# EAGLE schematic dice_3 (1) (EAGLE 9.6.2)
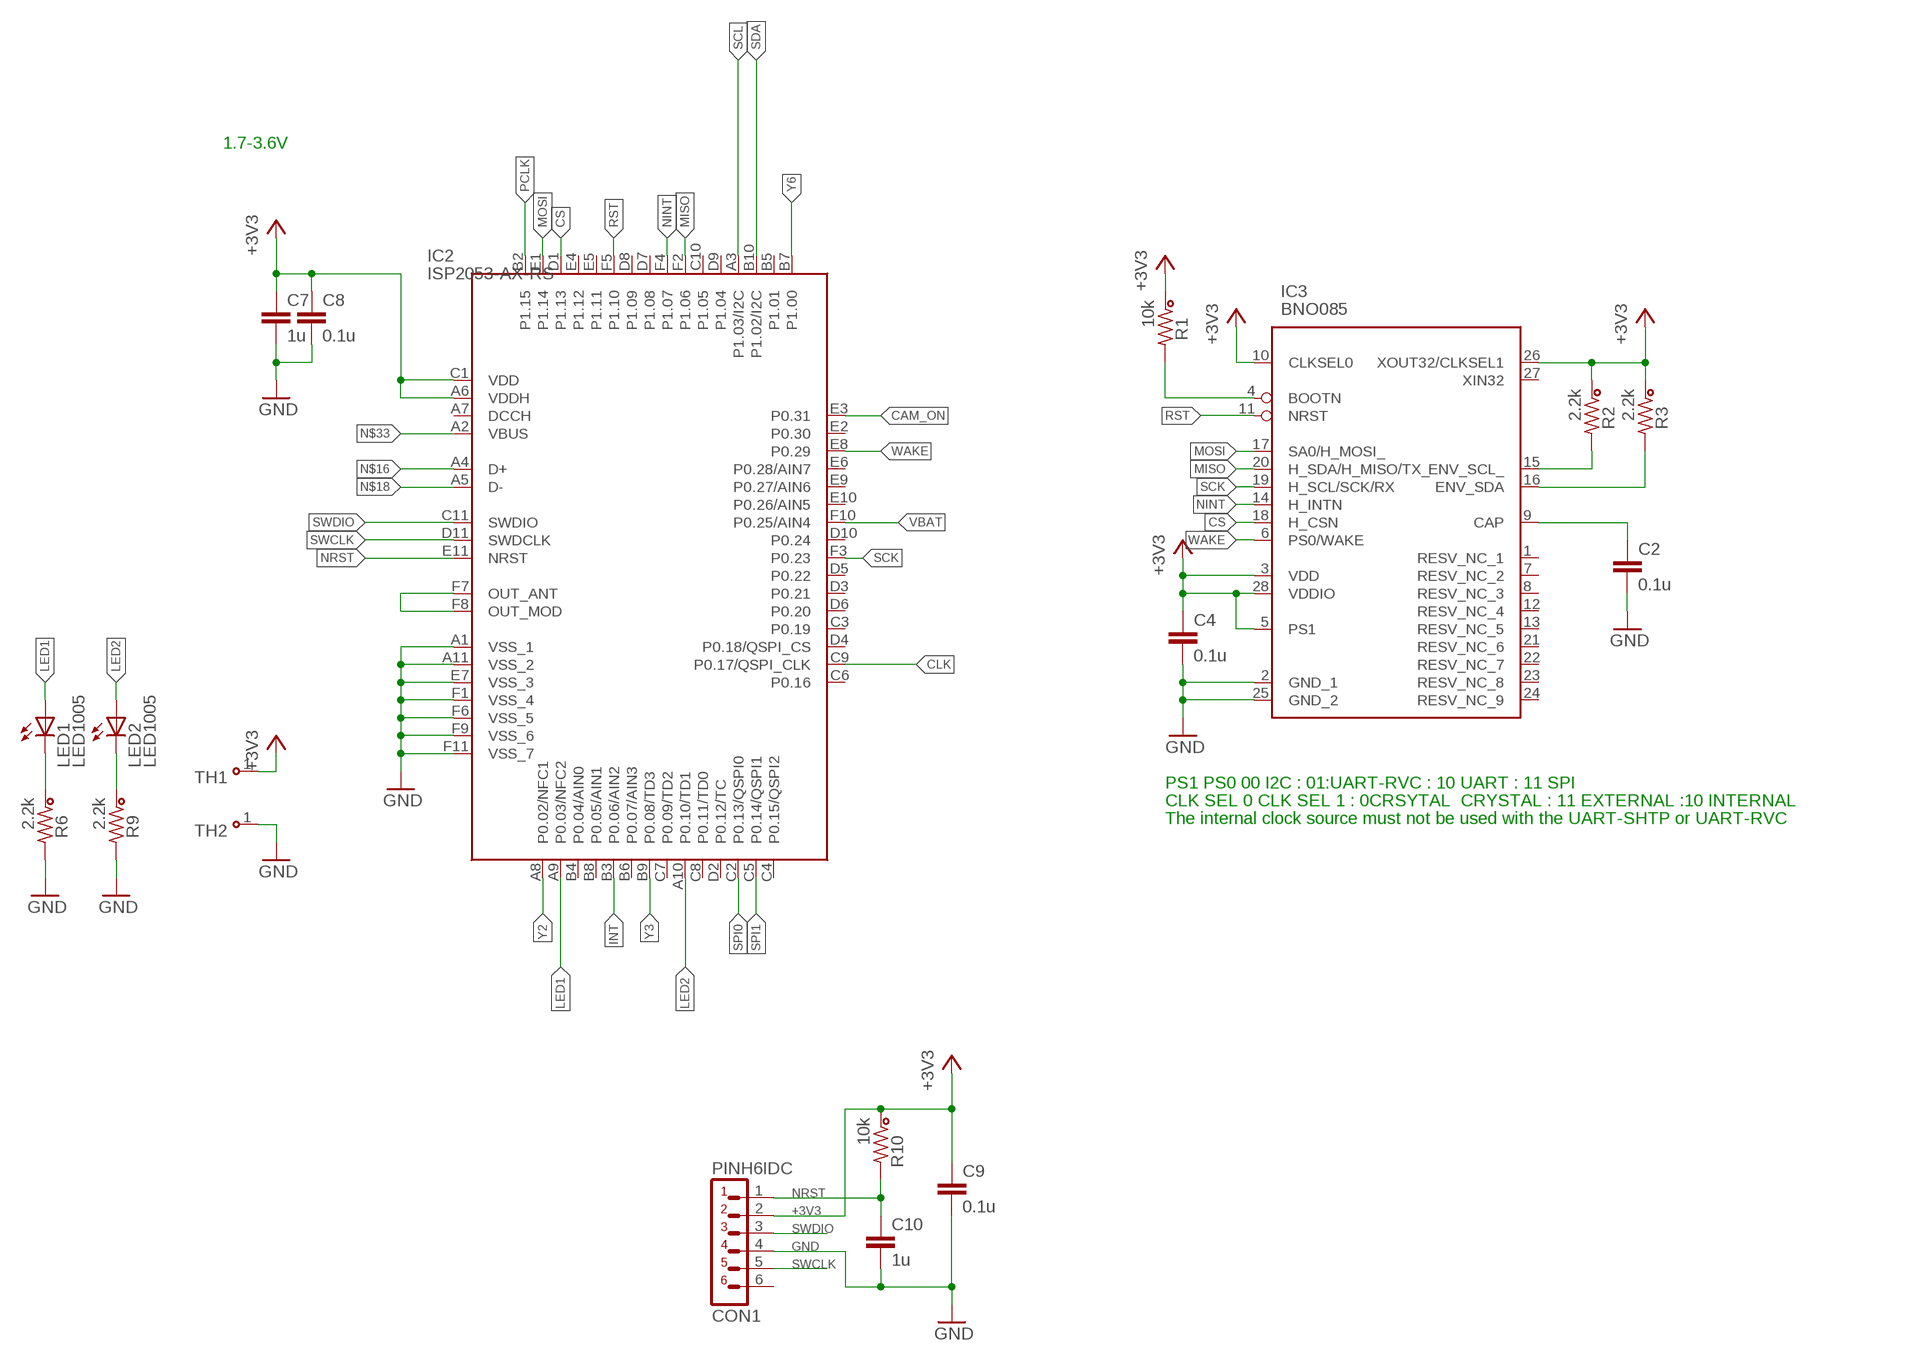
[diagram p0: schematic, sheet 1]

## Parts
C2  0.1u  C-CC1005K  [1005K]
C4  0.1u  C-CC1005K  [1005K]
C7  1u  C-CC1005K  [1005K]
C8  0.1u  C-CC1005K  [1005K]
C9  0.1u  C-CC1005K  [1005K]
C10  1u  C-CC1005K  [1005K]
CON1  PINH6IDC  [1X6IDC_1R27]
IC2  ISP2053-AX-RS  [ISP2053AXRS]
IC3  BNO085  [BNO085]
LED1  LED1005  [1005K-LED]
LED2  LED1005  [1005K-LED]
R1  10k  R-CC1005K  [1005K]
R2  2.2k  R-CC1005K  [1005K]
R3  2.2k  R-CC1005K  [1005K]
R6  2.2k  R-CC1005K  [1005K]
R9  2.2k  R-CC1005K  [1005K]
R10  10k  R-CC1005K  [1005K]
TH1  THCHK  [03C]
TH2  THCHK  [03C]

## Nets
+3V3: C4.1 C7.1 C8.1 C9.1 CON1.2 IC2.A6(VDDH) IC2.C1(VDD) IC3.3(VDD) IC3.5(PS1) IC3.10(CLKSEL0) IC3.26(XOUT32/CLKSEL1) IC3.28(VDDIO) R1.1 R2.1 R3.1 R10.1 TH1.1
CAM_ON: IC2.E3(P0.31)
CLK: IC2.C9(P0.17/QSPI_CLK)
CS: IC2.D1(P1.13) IC3.18(H_CSN)
GND: C2.2 C4.2 C7.2 C8.2 C9.2 C10.2 CON1.4 IC2.A1(VSS_1) IC2.A11(VSS_2) IC2.E7(VSS_3) IC2.F1(VSS_4) IC2.F6(VSS_5) IC2.F9(VSS_6) IC2.F11(VSS_7) IC3.2(GND_1) IC3.25(GND_2) R6.2 R9.2 TH2.1
INT: IC2.B3(P0.06/AIN2)
LED1: IC2.A9(P0.03/NFC2) LED1.A
LED2: IC2.A10(P0.10/TD1) LED2.A
MISO: IC2.F2(P1.06) IC3.20(H_SDA/H_MISO/TX_)
MOSI: IC2.E1(P1.14) IC3.17(SA0/H_MOSI_)
N$1: LED2.K(C) R9.1
N$2: IC2.F7(OUT_ANT) IC2.F8(OUT_MOD)
N$3: LED1.K(C) R6.1
N$4: C2.1 IC3.9(CAP)
N$5: IC3.4(BOOTN) R1.2
N$6: IC3.15(ENV_SCL_) R2.2
N$7: IC3.16(ENV_SDA) R3.2
N$16: IC2.A4(D+)
N$18: IC2.A5(D-)
N$33: IC2.A2(VBUS)
NINT: IC2.F4(P1.07) IC3.14(H_INTN)
NRST: C10.1 CON1.1 IC2.E11(NRST) R10.2
PCLK: IC2.B2(P1.15)
RST: IC2.F5(P1.10) IC3.11(NRST)
SCK: IC2.F3(P0.23) IC3.19(H_SCL/SCK/RX)
SCL: IC2.A3(P1.03/I2C)
SDA: IC2.B10(P1.02/I2C)
SPI0: IC2.C2(P0.13/QSPI0)
SPI1: IC2.C5(P0.14/QSPI1)
SWCLK: CON1.5 IC2.D11(SWDCLK)
SWDIO: CON1.3 IC2.C11(SWDIO)
VBAT: IC2.F10(P0.25/AIN4)
WAKE: IC2.E8(P0.29) IC3.6(PS0/WAKE)
Y2: IC2.A8(P0.02/NFC1)
Y3: IC2.B9(P0.08/TD3)
Y6: IC2.B7(P1.00)
Unconnected: CON1.6 IC2.A7(DCCH) IC2.B4(P0.04/AIN0) IC2.B5(P1.01) IC2.B6(P0.07/AIN3) IC2.B8(P0.05/AIN1) IC2.C3(P0.19) IC2.C4(P0.15/QSPI2) IC2.C6(P0.16) IC2.C7(P0.09/TD2) IC2.C8(P0.11/TD0) IC2.C10(P1.05) IC2.D2(P0.12/TC) IC2.D3(P0.21) IC2.D4(P0.18/QSPI_CS) IC2.D5(P0.22) IC2.D6(P0.20) IC2.D7(P1.08) IC2.D8(P1.09) IC2.D9(P1.04) IC2.D10(P0.24) IC2.E2(P0.30) IC2.E4(P1.12) IC2.E5(P1.11) IC2.E6(P0.28/AIN7) IC2.E9(P0.27/AIN6) IC2.E10(P0.26/AIN5) IC3.1(RESV_NC_1) IC3.7(RESV_NC_2) IC3.8(RESV_NC_3) IC3.12(RESV_NC_4) IC3.13(RESV_NC_5) IC3.21(RESV_NC_6) IC3.22(RESV_NC_7) IC3.23(RESV_NC_8) IC3.24(RESV_NC_9) IC3.27(XIN32)

## Notes on the sheet
- 1.7-3.6V
- PS1 PS0 00 I2C : 01:UART-RVC : 10 UART : 11 SPI
- CLK SEL 0 CLK SEL 1 : 0CRSYTAL  CRYSTAL : 11 EXTERNAL :10 INTERNAL
- The internal clock source must not be used with the UART-SHTP or UART-RVC

## Library data of the parts
C2 C4 C7-C10 = dac:C-CC
CON1 = dac:PINH6
IC2 = SamacSys_Parts:ISP2053-AX-RS: Bluetooth Modules - 802.15.1 ISP2053-AX nRF5340 Bluetooth 5.2 LE Audio, DF and Long Range Module Source: Datasheet <https://www.insightsip.com/fichiers_insightsip/pdf/ble/ISP2053/isp_ble_DS2053.pdf>; DESCRIPTION: Bluetooth Modules - 802.15.1 ISP2053-AX nRF5340 Bluetooth 5.2 LE Audio, DF and Long Range Module; HEIGHT: 1mm; MANUFACTURER_NAME: Insight SIP; MANUFACTURER_PART_NUMBER: ISP2053-AX-RS; MOUSER_PART_NUMBER: 359-ISP2053-AX-RS; MOUSER_PRICE-STOCK: https://www.mouser.co.uk/ProductDetail/Insight-SiP/ISP2053-AX-RS?qs=pBJMDPsKWf1vrfOoG2vJ6g%3D%3D
IC3 = SamacSys_Parts:BNO085: Board Mount Motion & Position Sensors 9-axis IMU Source: Datasheet <https://www.ceva-dsp.com/wp-content/uploads/2019/10/BNO080_085-Datasheet.pdf>; DESCRIPTION: Board Mount Motion & Position Sensors 9-axis IMU; HEIGHT: 1.18mm; MANUFACTURER_NAME: CEVA; MANUFACTURER_PART_NUMBER: BNO085; MOUSER_PART_NUMBER: 526-BNO085; MOUSER_PRICE-STOCK: https://www.mouser.co.uk/ProductDetail/CEVA/BNO085?qs=ulEaXIWI0c9BFVeZDQCmmQ%3D%3D
LED1 LED2 = dac:LED: LED rectangle, 5.7 x 3.2 mm
R1-R3 R6 R9 R10 = dac:R-CC
TH1 TH2 = dac:TH